# EAGLE design EEGbreakoutREVB (EAGLE 7.1.0)
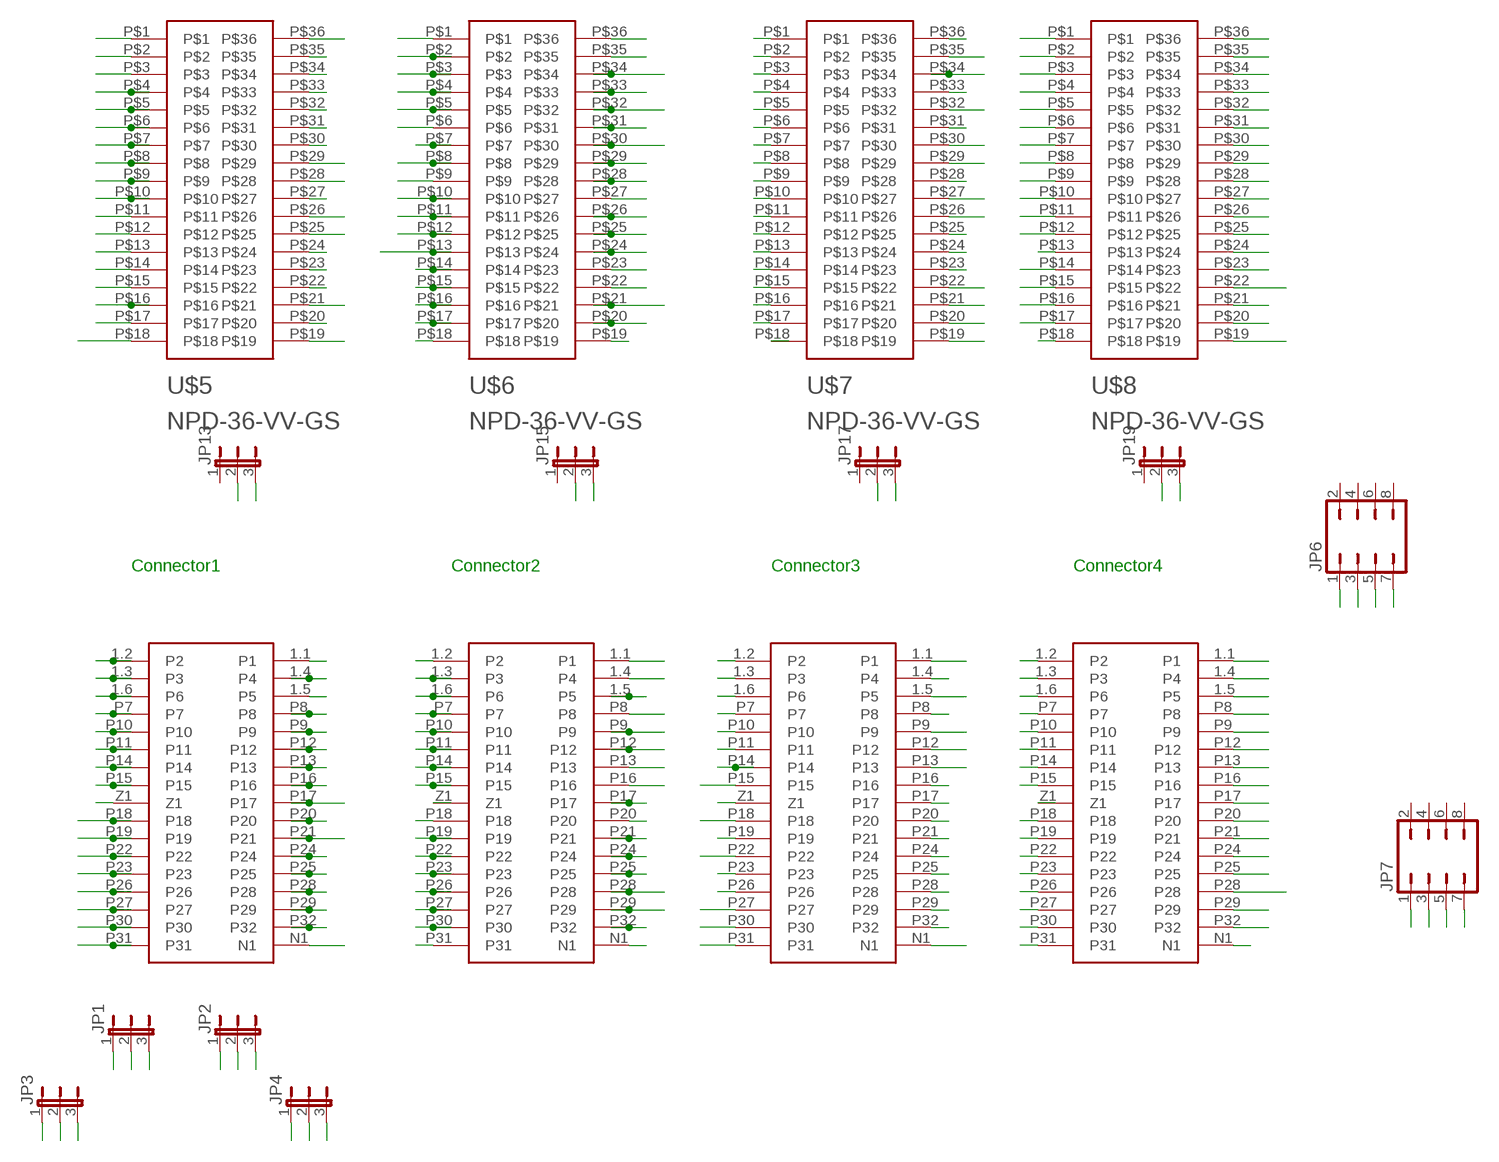
[diagram p0: schematic, sheet 1]

## Parts
JP1  JP2E  [JP2]
JP2  JP2E  [JP2]
JP3  JP2E  [JP2]
JP4  JP2E  [JP2]
JP6  JP4Q  [JP4Q]
JP7  JP4Q  [JP4Q]
JP13  JP2E  [JP2]
JP15  JP2E  [JP2]
JP17  JP2E  [JP2]
JP19  JP2E  [JP2]
U$1  P50  [CON-MOLEX_71061-0003SM]
U$2  P50  [CON-MOLEX_71061-0003SM]
U$3  P50  [CON-MOLEX_71061-0003SM]
U$4  P50  [CON-MOLEX_71061-0003SM]
U$5  NPD-36-VV-GS  [NPD-36-VV-GS]
U$6  NPD-36-VV-GS  [NPD-36-VV-GS]
U$7  NPD-36-VV-GS  [NPD-36-VV-GS]
U$8  NPD-36-VV-GS  [NPD-36-VV-GS]

## Nets
1.1: U$1.1.1(P1) U$5.P$2
1.2: U$1.1.4(P4) U$5.P$3
1.3: U$1.1.5(P5) U$5.P$4
1.4: U$1.P8 U$5.P$5
1.5: U$1.P9 U$5.P$6
1.6: U$1.P12 U$5.P$7
1.7: U$1.P13 U$5.P$8
1.8: U$1.P16 U$5.P$9
1.9: U$1.P17 U$5.P$10
1.10: U$1.P20 U$5.P$11
1.11: U$1.P21 U$5.P$12
1.12: U$1.P24 U$5.P$13
1.13: U$1.P25 U$5.P$14
1.14: U$1.P28 U$5.P$15
1.15: U$1.P29 U$5.P$16
1.16: U$1.P32 U$5.P$17
1.17: U$1.1.2(P2) U$5.P$20
1.18: U$1.1.3(P3) U$5.P$21
1.20: U$1.P7 U$5.P$23
1.21: U$1.P10 U$5.P$24
1.22: U$1.P11 U$5.P$25
1.23: U$1.P14 U$5.P$26
1.24: U$1.P15 U$5.P$27
1.25: U$1.P18 U$5.P$28
1.26: U$1.P19 U$5.P$29
1.27: U$1.P22 U$5.P$30
1.28: U$1.P23 U$5.P$31
1.29: JP4.2 U$5.P$32
1.30: JP2.2 U$5.P$33
1.31: JP1.2 U$5.P$34
1.32: JP3.2 U$5.P$35
2.1: U$2.1.1(P1) U$6.P$2
2.2: U$2.1.4(P4) U$6.P$3
2.3: U$2.1.5(P5) U$6.P$4
2.4: U$2.P8 U$6.P$5
2.5: U$2.P9 U$6.P$6
2.6: U$2.P12 U$6.P$7
2.7: U$2.P13 U$6.P$8
2.8: U$2.P16 U$6.P$9
2.9: U$2.P17 U$6.P$10
2.10: U$2.P20 U$6.P$11
2.11: U$2.P21 U$6.P$12
2.12: U$2.P24 U$6.P$13
2.13: U$2.P25 U$6.P$14
2.14: U$2.P28 U$6.P$15
2.15: U$2.P29 U$6.P$16
2.16: U$2.P32 U$6.P$17
2.17: U$2.1.2(P2) U$6.P$20
2.18: U$2.1.3(P3) U$6.P$21
2.19: U$2.1.6(P6) U$6.P$22
2.20: U$2.P7 U$6.P$23
2.21: U$2.P10 U$6.P$24
2.22: U$2.P11 U$6.P$25
2.23: U$2.P14 U$6.P$26
2.24: U$2.P15 U$6.P$27
2.25: U$2.P18 U$6.P$28
2.26: U$2.P19 U$6.P$29
2.27: U$2.P22 U$6.P$30
2.28: U$2.P23 U$6.P$31
2.29: U$2.P26 U$6.P$32
2.30: U$2.P27 U$6.P$33
2.31: U$2.P30 U$6.P$34
2.32: U$2.P31 U$6.P$35
3.1: U$3.1.1(P1) U$7.P$2
3.2: U$3.1.4(P4) U$7.P$3
3.3: U$3.1.5(P5) U$7.P$4
3.4: U$3.P8 U$7.P$5
3.5: U$3.P9 U$7.P$6
3.6: U$3.P12 U$7.P$7
3.7: U$3.P13 U$7.P$8
3.8: U$3.P16 U$7.P$9
3.9: U$3.P17 U$7.P$10
3.10: U$3.P20 U$7.P$11
3.11: U$3.P21 U$7.P$12
3.12: U$3.P24 U$7.P$13
3.13: U$3.P25 U$7.P$14
3.14: U$3.P28 U$7.P$15
3.15: U$3.P29 U$7.P$16
3.16: U$3.P32 U$7.P$17
3.17: U$3.1.2(P2) U$7.P$20
3.18: U$3.1.3(P3) U$7.P$21
3.19: U$3.1.6(P6) U$7.P$22
3.20: U$3.P7 U$7.P$23
3.21: U$3.P10 U$7.P$24
3.22: U$3.P11 U$7.P$25
3.23: U$3.P14 U$7.P$26
3.24: U$3.P15 U$7.P$27
3.25: U$3.P18 U$7.P$28
3.26: U$3.P19 U$7.P$29
3.27: U$3.P22 U$7.P$30
3.28: U$3.P23 U$7.P$31
3.29: U$3.P26 U$7.P$32
3.30: U$3.P27 U$7.P$33
3.31: U$3.P30 U$7.P$34
3.32: U$3.P31 U$7.P$35
4.1: U$4.1.1(P1) U$8.P$2
4.2: U$4.1.4(P4) U$8.P$3
4.3: U$4.1.5(P5) U$8.P$4
4.4: U$4.P8 U$8.P$5
4.5: U$4.P9 U$8.P$6
4.6: U$4.P12 U$8.P$7
4.7: U$4.P13 U$8.P$8
4.8: U$4.P16 U$8.P$9
4.9: U$4.P17 U$8.P$10
4.10: U$4.P20 U$8.P$11
4.11: U$4.P21 U$8.P$12
4.12: U$4.P24 U$8.P$13
4.13: U$4.P25 U$8.P$14
4.14: U$4.P28 U$8.P$15
4.15: U$4.P29 U$8.P$16
4.16: U$4.P32 U$8.P$17
4.17: U$4.1.2(P2) U$8.P$20
4.18: U$4.1.3(P3) U$8.P$21
4.19: U$4.1.6(P6) U$8.P$22
4.20: U$4.P7 U$8.P$23
4.21: U$4.P10 U$8.P$24
4.22: U$4.P11 U$8.P$25
4.23: U$4.P14 U$8.P$26
4.24: U$4.P15 U$8.P$27
4.25: U$4.P18 U$8.P$28
4.26: U$4.P19 U$8.P$29
4.27: U$4.P22 U$8.P$30
4.28: U$4.P23 U$8.P$31
4.29: U$4.P26 U$8.P$32
4.30: U$4.P27 U$8.P$33
4.31: U$4.P30 U$8.P$34
4.32: U$4.P31 U$8.P$35
C1.29: JP4.1 U$1.P26
C1.30: JP2.1 U$1.P27
C1.31: JP1.1 U$1.P30
C1.32: JP3.1 U$1.P31
GND: JP13.3 JP15.3 JP17.3 JP19.3 U$1.N1 U$2.N1 U$3.N1 U$4.N1 U$5.P$1 U$5.P$19 U$6.P$1 U$6.P$19 U$7.P$1 U$7.P$19 U$8.P$1 U$8.P$19
J29: JP4.3 JP6.1
J30: JP2.3 JP6.3
J31: JP1.3 JP6.5
J32: JP3.3 JP6.7
N$10: U$1.1.6(P6) U$5.P$22
REF: JP7.1 JP13.2 U$1.Z1 U$5.P$18 U$5.P$36
REF1: JP7.3 JP15.2 U$2.Z1 U$6.P$18 U$6.P$36
REF2: JP7.5 JP17.2 U$3.Z1 U$7.P$18 U$7.P$36
REF3: JP7.7 JP19.2 U$4.Z1 U$8.P$18 U$8.P$36
Unconnected: JP6.2 JP6.4 JP6.6 JP6.8 JP7.2 JP7.4 JP7.6 JP7.8 JP13.1 JP15.1 JP17.1 JP19.1

## Notes on the sheet
- Connector1 | Connector2 | Connector3 | Connector4

## Library data of the parts
JP1-JP4 JP13 JP15 JP17 JP19 = jumper:JP2E: JUMPER
JP6 JP7 = jumper:JP4Q: JUMPER
U$1-U$4 = MS001-1_4xNutzEURO:P50
U$5-U$8 = connectors:NPD-36-VV-GS: Omnetics 36-pin connector, vertical surface-mount

## Board
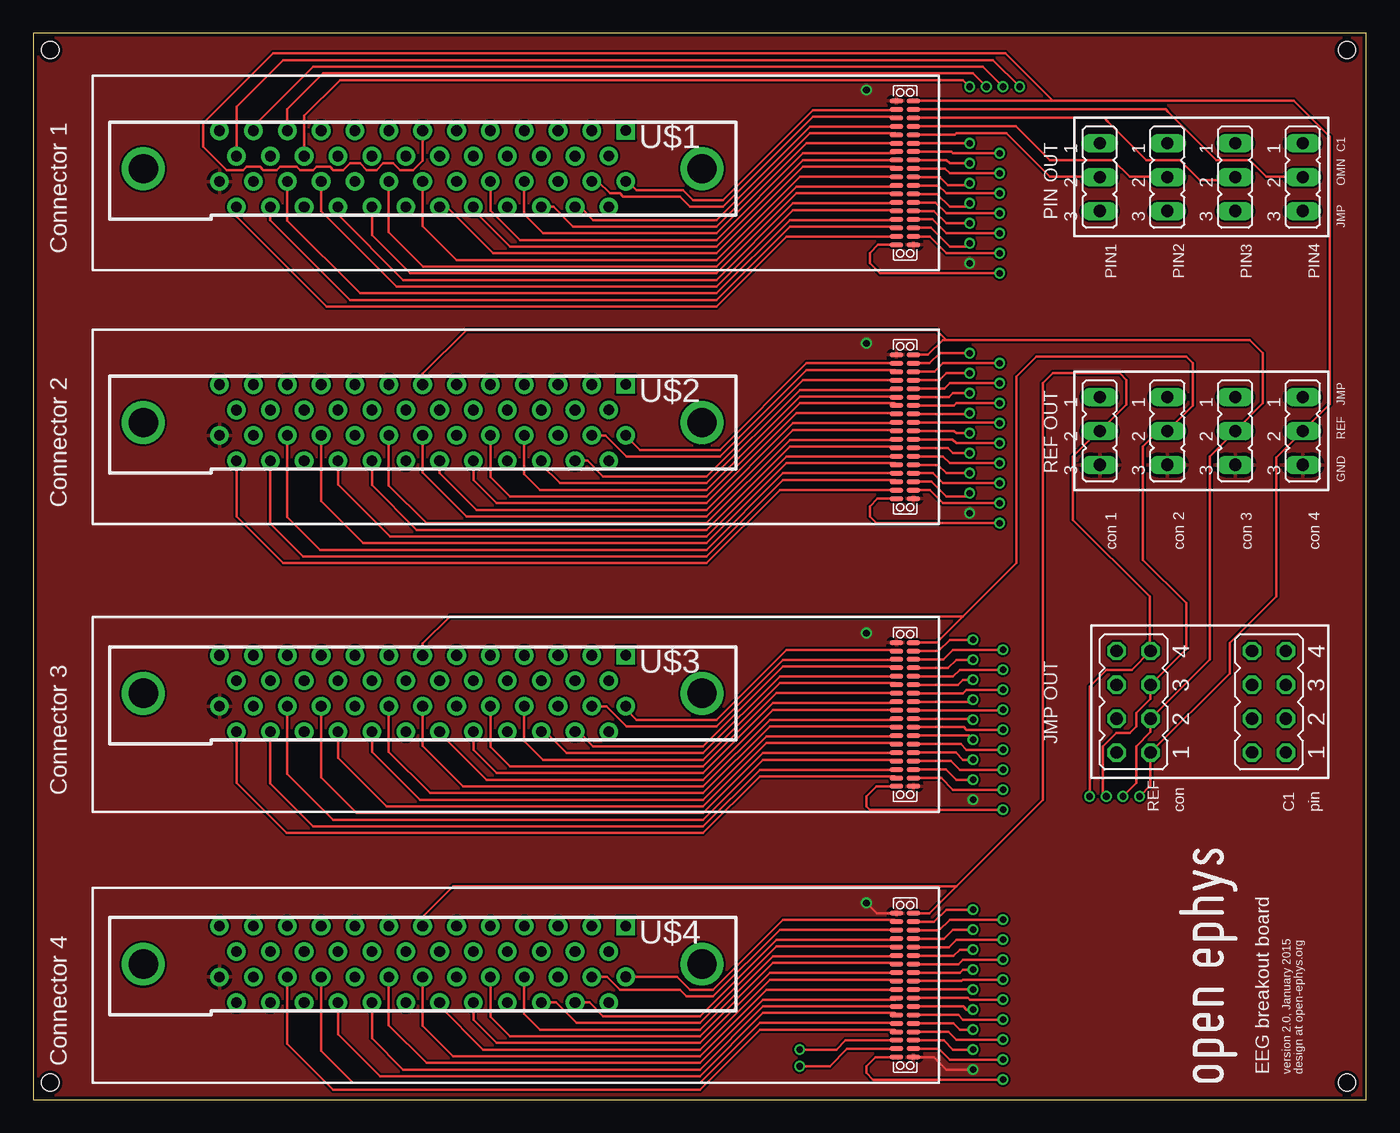
[diagram p1: board, top side]
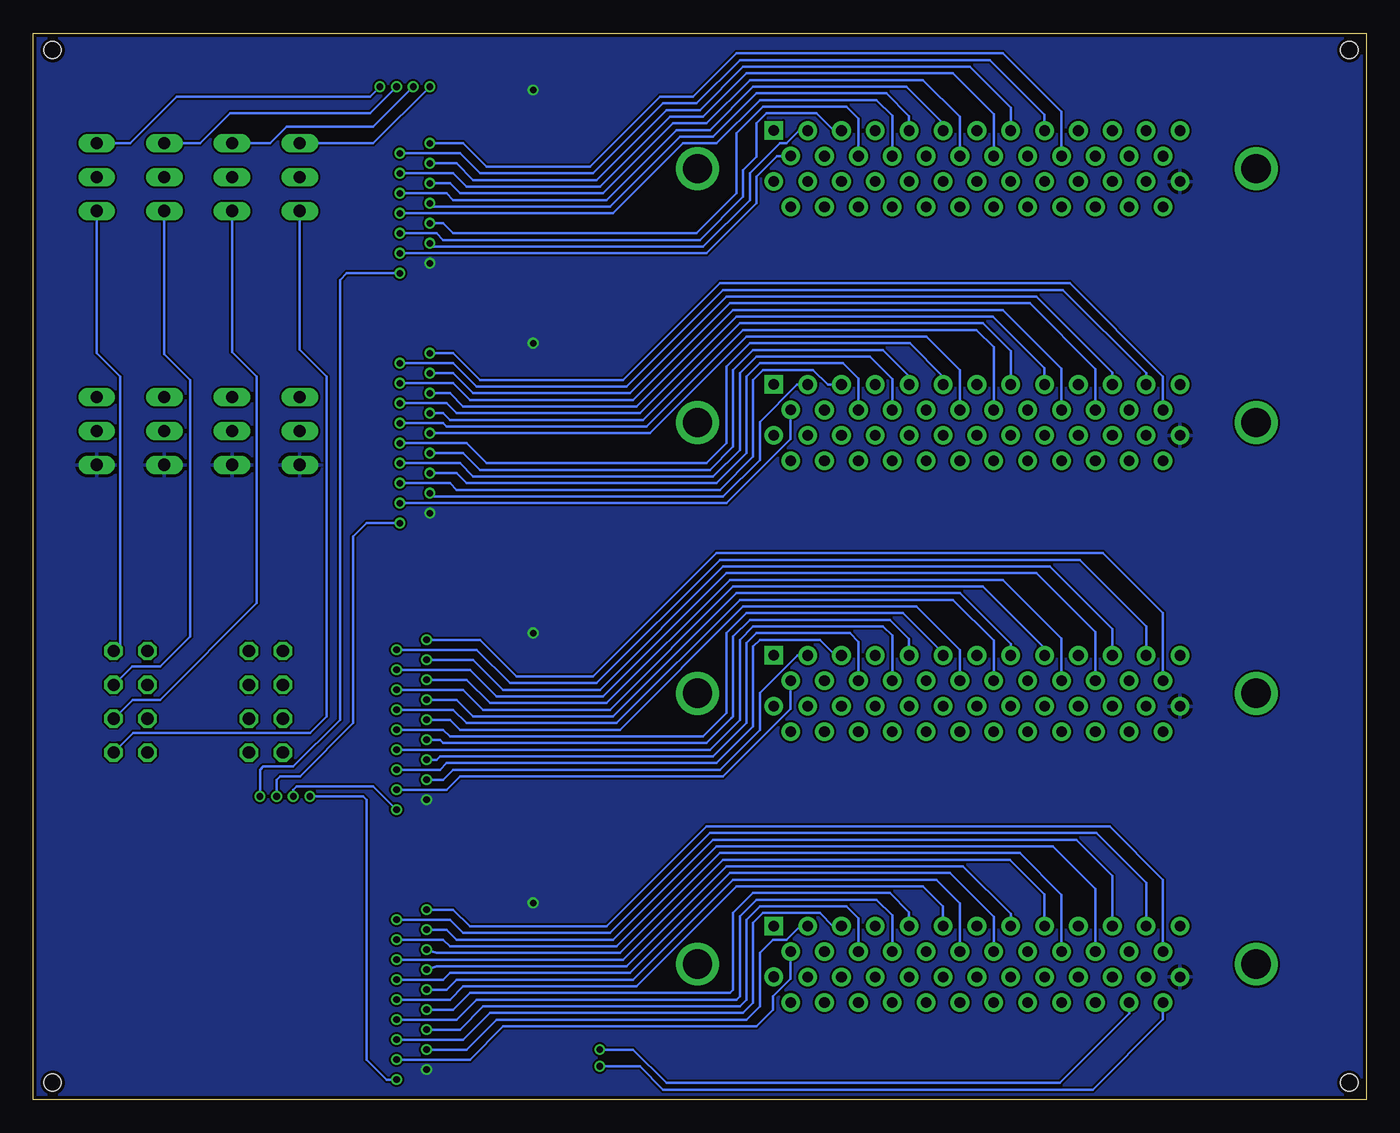
[diagram p2: board, bottom side, seen from below]

Size 100 x 80 mm. Coordinates in mm from the lower left corner, seen from the top.
Outline: 0,0 100,0 100,80 0,80 0,0
Copper layers (1*16): Top 0.035mm / dielectric 0.2mm / Bottom 0.035mm
Design rules "SeeedStudio_DRU_no_angle_20130527 *": minimum track width 6mil, minimum drill 12mil, track to track 6mil, track to pad 6mil, pad to pad 6mil, via to via 6mil, smd to smd 0mil, copper to edge 10mil, drill to drill 10mil, minimum pad ring 6mil, minimum via ring 6mil, stop-mask expansion 2mil, vias tented up to drill 25mil, thermal gap 10mil
Holes 1.3 mm at 98.55,78.74 98.55,1.27 1.27,78.74 1.27,1.27

### Footprints (pad centres in the part's own frame; a part is rotated, then mirrored left to right if it is on the bottom)
JP2 = drill 0.914 long: 1 -2.54,0; 2 0,0; 3 2.54,0
JP4Q = drill 0.914 octagon: 1 -3.81,-1.27; 2 -3.81,1.27; 3 -1.27,-1.27; 4 -1.27,1.27; 5 1.27,-1.27; 6 1.27,1.27; 7 3.81,-1.27; 8 3.81,1.27
CON-MOLEX_71061-0003SM = drill 0.8 pad 1.4 square: 0 15.24,2.857 | drill 0.8 pad 1.4: 1.1 15.24,-0.958; 1.2 13.97,0.943; 1.3 12.7,2.842; 1.4 12.7,-0.968; 1.5 11.43,-2.873; 1.6 10.16,2.842; 4 13.97,-2.873; 7 11.43,0.938; 10 10.16,-0.968; 13 7.62,2.842; 16 6.35,-2.873; 19 3.81,0.938; 22 2.54,-0.968; 28 -1.27,-2.873; 31 -3.81,0.938; 34 -5.08,-0.968; 37 -7.62,2.842; 40 -8.89,-2.873; 43 -11.43,0.938; 46 -12.7,-0.968; 49 -15.24,2.842; N1 -15.24,-0.968; P7 8.89,0.938; P8 8.89,-2.873; P9 7.62,-0.968; P10 6.35,0.938; P11 5.08,2.842; P12 5.08,-0.968; P13 3.81,-2.873; P14 2.54,2.842; P15 1.27,0.938; P16 1.27,-2.873; P17 0,-0.968; P18 -1.27,0.938; P19 -2.54,2.842; P20 -2.54,-0.968; P21 -3.81,-2.873; P22 -5.08,2.842; P23 -6.35,0.938; P24 -6.35,-2.873; P25 -7.62,-0.968; P26 -8.89,0.938; P27 -10.16,2.842; P28 -10.16,-0.968; P29 -11.43,-2.873; P30 -12.7,2.842; P31 -13.97,0.938; P32 -13.97,-2.873; Z1 0,2.842 | drill 2.2 pad 2.6: Y1 20.955,0; Y2 -20.955,0
NPD-36-VV-GS = smd 0.381 x 1.016: P$1 0,0; P$2 0.635,0; P$3 1.27,0; P$4 1.905,0; P$5 2.54,0; P$6 3.175,0; P$7 3.81,0; P$8 4.445,0; P$9 5.08,0; P$10 5.715,0; P$11 6.35,0; P$12 6.985,0; P$13 7.62,0; P$14 8.255,0; P$15 8.89,0; P$16 9.525,0; P$17 10.16,0; P$18 10.795,0; P$19 10.795,1.27; P$20 10.16,1.27; P$21 9.525,1.27; P$22 8.89,1.27; P$23 8.255,1.27; P$24 7.62,1.27; P$25 6.985,1.27; P$26 6.35,1.27; P$27 5.715,1.27; P$28 5.08,1.27; P$29 4.445,1.27; P$30 3.81,1.27; P$31 3.175,1.27; P$32 2.54,1.27; P$33 1.905,1.27; P$34 1.27,1.27; P$35 0.635,1.27; P$36 0,1.27

### Placement (x,y rotation side)
JP1  90.17,69.22 270 top
JP2  85.09,69.22 270 top
JP3  95.25,69.22 270 top
JP4  80.01,69.22 270 top
JP6  92.71,29.84 90 top
JP7  82.55,29.84 90 top
JP13  95.25,50.16 270 top
JP15  90.17,50.16 270 top
JP17  85.09,50.16 270 top
JP19  80.01,50.16 270 top
U$1  29.21,69.85 0 top
U$2  29.21,50.8 0 top
U$3  29.21,30.48 0 top
U$4  29.21,10.16 0 top
U$5  64.77,74.93 270 top
U$6  64.77,55.88 270 top
U$7  64.77,34.29 270 top
U$8  64.77,13.97 270 top
U$9  [OPEN_EPHYS_LOGO]  90.81,0.64 90 top

### Tracks (layer width: path | path; a pad name or v marks a point on that pad's centre or on a via)
1.1
  Top 0.2: U$1.1.1 44.61,68.89 45.25,68.25 48.75,68.25 49.5,67.5 51.75,67.5 58.5,74.25 64.72,74.25 U$5.P$2
1.2
  Top 0.2: U$5.P$3 64.68,73.75 58.5,73.75 51.75,67 49.25,67 48.5,67.75 44.25,67.75 44,68 43.25,68 42.37,68.88 U$1.1.4
1.3
  Top 0.2: U$1.1.5 41.02,66.98 42,66 51.25,66 58.25,73 64.75,73 U$5.P$4
1.4
  Top 0.2: U$1.P8 39.02,66.98 40.5,65.5 51.25,65.5 58.25,72.5 64.66,72.5 U$5.P$5
1.5
  Top 0.2: U$1.P9 36.83,66.42 38.25,65 51.25,65 58,71.75 U$5.P$6
1.6
  Top 0.2: U$1.P12 34.29,66.71 36.5,64.5 51.25,64.5 57.75,71 64.65,71 U$5.P$7
1.7
  Top 0.2: U$1.P13 33.02,66.73 35.75,64 51.25,64 57.75,70.5 64.75,70.5 U$5.P$8
1.8
  Top 0.2: U$1.P16 31.02,66.98 34.5,63.5 51.25,63.5 57.75,70 64.62,70 U$5.P$9
1.9
  Top 0.2: U$1.P17 29.21,65.54 31.75,63 51.25,63 57.5,69.25 64.73,69.25 U$5.P$10
1.10
  Top 0.2: U$1.P20 26.67,65.08 29.25,62.5 51.25,62.5 57.25,68.5 64.69,68.5 U$5.P$11
1.11
  Top 0.2: U$1.P21 25.4,64.85 28.25,62 51.25,62 57.25,68 64.72,68 U$5.P$12
1.12
  Top 0.2: U$1.P24 22.86,66.39 27.75,61.5 51.25,61.5 57,67.25 64.71,67.25 U$5.P$13
1.13
  Top 0.2: U$1.P25 21.59,66.66 27.25,61 51.25,61 57,66.75 64.69,66.75 U$5.P$14
1.14
  Top 0.2: U$1.P28 19.05,65.95 24.5,60.5 51.25,60.5 56.75,66 64.73,66 U$5.P$15
1.15
  Top 0.2: U$1.P29 17.78,65.97 23.75,60 51.25,60 56.75,65.5 64.67,65.5 U$5.P$16
1.16
  Top 0.2: U$1.P32 15.24,66.26 22,59.5 51.25,59.5 56.5,64.75 64.75,64.75 U$5.P$17
1.17  (via drill 0.5 pad 0.25)
  Top 0.2: v72.5,63.5 68.5,63.5 67.25,64.75 66.06,64.75 U$5.P$20
  Bottom 0.2: U$1.1.2 44.21,70.79 45.75,69.25 45.75,67.25 49.5,63.5 v72.5,63.5
1.18  (via drill 0.5 pad 0.25)
  Top 0.2: U$5.P$21 67.34,65.41 68.75,64 70,64 v70.25,64.25
  Bottom 0.2: U$1.1.3 42.56,72.69 43.5,71.75 44,71.75 46.25,69.5 46.25,67.5 49.75,64 70,64 v70.25,64.25
1.20  (via drill 0.5 pad 0.25)
  Top 0.2: U$5.P$23 67.58,66.67 68.5,65.75 v70.25,65.75
  Bottom 0.2: U$1.P7 38.1,73.6 39,74.5 45.25,74.5 47.25,72.5 47.25,68 50.25,65 68.5,65 69.25,65.75 v70.25,65.75
1.21  (via drill 0.5 pad 0.25)
  Top 0.2: U$5.P$24 67.69,67.31 68.5,66.5 v72.5,66.5
  Bottom 0.2: U$1.P10 35.56,73.81 36.75,75 45.5,75 48.75,71.75 51.25,71.75 56.5,66.5 v72.5,66.5
1.22  (via drill 0.5 pad 0.25)
  Top 0.2: U$5.P$25 67.81,67.94 68.75,67 70,67 v70.25,67.25
  Bottom 0.2: U$1.P11 34.29,73.79 36,75.5 45.75,75.5 49,72.25 51.5,72.25 56.75,67 70,67 v70.25,67.25
1.23  (via drill 0.5 pad 0.25)
  Top 0.2: U$5.P$26 67.92,68.58 68.5,68 v72.5,68
  Bottom 0.2: U$1.P14 31.75,73.25 34.5,76 46,76 49.25,72.75 51.75,72.75 57,67.5 68.5,67.5 69,68 v72.5,68
1.24  (via drill 0.5 pad 0.25)
  Top 0.2: U$5.P$27 68.03,69.22 68.62,68.62 70.12,68.62 v70.25,68.75
  Bottom 0.2: U$1.P15 30.48,73.73 33.25,76.5 46.25,76.5 49.5,73.25 52,73.25 57.25,68 68,68 68.75,68.75 v70.25,68.75
1.25  (via drill 0.5 pad 0.25)
  Top 0.2: U$5.P$28 68.4,69.85 68.75,69.5 v72.5,69.5
  Bottom 0.2: U$1.P18 27.94,73.94 31,77 46.5,77 49.75,73.75 52.25,73.75 57.5,68.5 67.5,68.5 68.5,69.5 v72.5,69.5
1.26  (via drill 0.5 pad 0.25)
  Top 0.2: U$5.P$29 68.52,70.48 68.75,70.25 v70.25,70.25
  Bottom 0.2: U$1.P19 26.67,74.42 29.75,77.5 46.75,77.5 50,74.25 52.5,74.25 57.75,69 67,69 68.25,70.25 v70.25,70.25
1.27  (via drill 0.5 pad 0.25)
  Top 0.2: U$5.P$30 68.88,71.12 69,71 v72.5,71
  Bottom 0.2: U$1.P22 24.13,73.88 28.25,78 47,78 50.25,74.75 52.75,74.75 58,69.5 66.5,69.5 68,71 v72.5,71
1.28  (via drill 0.5 pad 0.25)
  Top 0.2: U$5.P$31 v70.25,71.75
  Bottom 0.2: U$1.P23 22.86,74.11 27.25,78.5 47.25,78.5 50.5,75.25 53,75.25 58.25,70 66,70 67.75,71.75 v70.25,71.75
1.29
  Top 0.2: JP4.2 79.97,69.25 76.25,69.25 73,72.5 69.25,72.5 69.14,72.39 U$5.P$32
1.30
  Top 0.2: JP2.2 85.06,69.25 82.25,69.25 81,70.5 76.25,70.5 73.72,73.03 U$5.P$33
1.31
  Top 0.2: JP1.2 89.95,69 87.5,69 86,70.5 83.5,70.5 80.62,73.38 80.34,73.66 U$5.P$34
1.32
  Top 0.2: JP3.2 95.22,69.25 92.5,69.25 91.25,70.5 88.75,70.5 85.12,74.12 84.95,74.3 U$5.P$35
2.1
  Top 0.2: U$2.1.1 44.45,49.8 45.5,48.75 51.5,48.75 58,55.25 U$6.P$2
2.2
  Top 0.2: U$2.1.4 42.92,49.83 44.5,48.25 51.5,48.25 58,54.75 64.63,54.75 U$6.P$3
2.3
  Top 0.2: U$2.1.5 41.57,47.93 42.75,46.75 50.5,46.75 57.75,54 64.75,54 U$6.P$4
2.4
  Top 0.2: U$2.P8 38.1,47.65 39.5,46.25 50.5,46.25 57.5,53.25 64.68,53.25 U$6.P$5
2.5
  Top 0.2: U$2.P9 36.83,46.92 38,45.75 50.5,45.75 57.5,52.75 64.72,52.75 U$6.P$6
2.6
  Top 0.2: U$2.P12 34.29,46.71 35.75,45.25 50.5,45.25 57.5,52.25 64.59,52.25 U$6.P$7
2.7
  Top 0.2: U$2.P13 33.02,46.48 34.75,44.75 50.5,44.75 57.25,51.5 64.7,51.5 U$6.P$8
2.8
  Top 0.2: U$2.P16 30.48,47.02 33.25,44.25 50.5,44.25 57,50.75 64.72,50.75 U$6.P$9
2.9
  Top 0.2: U$2.P17 29.21,47.04 32.5,43.75 50.5,43.75 57,50.25 64.69,50.25 U$6.P$10
2.10
  Top 0.2: U$2.P20 26.67,46.08 29.5,43.25 50.5,43.25 56.75,49.5 64.74,49.5 U$6.P$11
2.11
  Top 0.2: U$2.P21 25.4,46.1 28.75,42.75 50.5,42.75 56.75,49 64.67,49 U$6.P$12
2.12
  Top 0.2: U$2.P24 22.86,46.14 26.75,42.25 50.5,42.25 56.5,48.25 U$6.P$13
2.13
  Top 0.2: U$2.P25 21.59,44.91 24.75,41.75 50.5,41.75 56.5,47.75 64.64,47.75 U$6.P$14
2.14
  Top 0.2: U$2.P28 19.05,43.7 21.5,41.25 50.5,41.25 56.25,47 U$6.P$15
2.15
  Top 0.2: U$2.P29 17.78,43.22 20.25,40.75 50.5,40.75 56.25,46.5 64.62,46.5 U$6.P$16
2.16
  Top 0.2: U$2.P32 15.24,43.76 18.75,40.25 50.5,40.25 56,45.75 56.03,45.72 U$6.P$17
2.17  (via drill 0.5 pad 0.25)
  Top 0.2: U$6.P$20 67.28,45.72 68.25,44.75 v72.5,44.75
  Bottom 0.2: U$2.1.2 43.18,49.57 48,44.75 v72.5,44.75
2.18  (via drill 0.5 pad 0.25)
  Top 0.2: U$6.P$21 67.39,46.35 68.5,45.25 70,45.25 v70.25,45.5
  Bottom 0.2: v70.25,45.5 70,45.25 48.25,45.25 45.5,48 45.5,50.84 42.7,53.64 U$2.1.3
2.19  (via drill 0.5 pad 0.25)
  Top 0.2: U$6.P$22 67.51,46.99 68.25,46.25 v72.5,46.25
  Bottom 0.2: U$2.1.6 40.39,53.64 41.5,54.75 45.25,54.75 46,54 46,48.25 48.5,45.75 68.25,45.75 68.75,46.25 v72.5,46.25
2.20  (via drill 0.5 pad 0.25)
  Top 0.2: U$6.P$23 67.88,47.62 68.5,47 v70.25,47
  Bottom 0.2: U$2.P7 38.1,54.1 39.25,55.25 45.5,55.25 46.5,54.25 46.5,48.5 48.75,46.25 67.5,46.25 68.25,47 v70.25,47
2.21  (via drill 0.5 pad 0.25)
  Top 0.2: U$6.P$24 68.24,48.26 68.75,47.75 v72.5,47.75
  Bottom 0.2: U$2.P10 35.56,54.06 37.25,55.75 45.75,55.75 47,54.5 47,48.75 49,46.75 67,46.75 68,47.75 v72.5,47.75
2.22  (via drill 0.5 pad 0.25)
  Top 0.2: U$6.P$25 68.61,48.9 69,48.5 v70.25,48.5
  Bottom 0.2: U$2.P11 34.29,54.29 36.25,56.25 46,56.25 47.5,54.75 47.5,49 49.25,47.25 66.5,47.25 67.75,48.5 v70.25,48.5
2.23  (via drill 0.5 pad 0.25)
  Top 0.2: U$6.P$26 68.97,49.53 69.25,49.25 v72.5,49.25
  Bottom 0.2: U$2.P14 31.75,54.25 34.25,56.75 46.25,56.75 48,55 48,49.25 49.5,47.75 66,47.75 67.5,49.25 v72.5,49.25
2.24  (via drill 0.5 pad 0.25)
  Top 0.2: U$6.P$27 69.08,50.16 69.25,50 v70.25,50
  Bottom 0.2: U$2.P15 30.48,54.73 33,57.25 46.5,57.25 53.75,50 v70.25,50
2.25  (via drill 0.5 pad 0.25)
  Top 0.2: U$6.P$28 72.45,50.8 v72.5,50.75
  Bottom 0.2: U$2.P18 27.94,56.44 29.25,57.75 46.75,57.75 54,50.5 69,50.5 69.25,50.75 v72.5,50.75
2.26  (via drill 0.5 pad 0.25)
  Top 0.2: U$6.P$29 70.19,51.44 v70.25,51.5
  Bottom 0.2: U$2.P19 26.67,56.17 28.75,58.25 47,58.25 54.25,51 68.75,51 69.25,51.5 v70.25,51.5
2.27  (via drill 0.5 pad 0.25)
  Top 0.2: U$6.P$30 69.07,52.07 69.25,52.25 v72.5,52.25
  Bottom 0.2: U$2.P22 24.13,54.88 28,58.75 47.25,58.75 54.5,51.5 68.25,51.5 69,52.25 v72.5,52.25
2.28  (via drill 0.5 pad 0.25)
  Top 0.2: U$6.P$31 68.7,52.7 69,53 v70.25,53
  Bottom 0.2: U$2.P23 22.86,54.86 27.25,59.25 47.5,59.25 54.75,52 67.75,52 68.75,53 v70.25,53
2.29  (via drill 0.5 pad 0.25)
  Top 0.2: U$6.P$32 68.34,53.34 68.75,53.75 v72.5,53.75
  Bottom 0.2: U$2.P26 20.32,54.82 25.25,59.75 47.75,59.75 55,52.5 67.25,52.5 68.5,53.75 v72.5,53.75
2.30  (via drill 0.5 pad 0.25)
  Top 0.2: U$6.P$33 67.97,53.98 68.5,54.5 v70.25,54.5
  Bottom 0.2: U$2.P27 19.05,54.55 24.75,60.25 48,60.25 55.25,53 67,53 68.5,54.5 v70.25,54.5
2.31  (via drill 0.5 pad 0.25)
  Top 0.2: U$6.P$34 67.61,54.61 68.25,55.25 v72.5,55.25
  Bottom 0.2: U$2.P30 16.51,54.51 22.75,60.75 48.25,60.75 55.5,53.5 66.75,53.5 68.5,55.25 v72.5,55.25
2.32  (via drill 0.5 pad 0.25)
  Top 0.2: U$6.P$35 67.25,55.24 68,56 v70.25,56
  Bottom 0.2: U$2.P31 15.24,54.24 22.25,61.25 48.5,61.25 55.75,54 66.5,54 68.5,56 v70.25,56
3.1
  Top 0.2: U$3.1.1 44.45,29.3 45.25,28.5 51.25,28.5 56.5,33.75 64.67,33.75 U$7.P$2
3.2
  Top 0.2: U$3.1.4 42.99,29.51 44.5,28 51.25,28 56.25,33 64.75,33 U$7.P$3
3.3
  Top 0.2: U$3.1.5 40.89,27.61 42,26.5 50.25,26.5 56.25,32.5 64.66,32.5 U$7.P$4
3.4
  Top 0.2: U$3.P8 38.39,27.61 40,26 50.25,26 56,31.75 U$7.P$5
3.5
  Top 0.2: U$3.P9 36.83,26.92 38.25,25.5 50.25,25.5 56,31.25 64.64,31.25 U$7.P$6
3.6
  Top 0.2: U$3.P12 34.29,26.46 35.75,25 50.25,25 55.75,30.5 64.75,30.5 U$7.P$7
3.7
  Top 0.2: U$3.P13 33.02,26.23 34.75,24.5 50.25,24.5 55.5,29.75 64.67,29.75 U$7.P$8
3.8
  Top 0.2: U$3.P16 30.48,27.52 34,24 50.25,24 55.5,29.25 64.73,29.25 U$7.P$9
3.9
  Top 0.2: U$3.P17 29.21,26.54 32.25,23.5 50.25,23.5 55.25,28.5 64.69,28.5 U$7.P$10
3.10
  Top 0.2: U$3.P20 26.67,26.08 29.75,23 50.25,23 55.25,28 64.71,28 U$7.P$11
3.11
  Top 0.2: U$3.P21 25.4,26.1 29,22.5 50.25,22.5 55,27.25 64.72,27.25 U$7.P$12
3.12
  Top 0.2: U$3.P24 22.86,25.64 26.5,22 50.25,22 55,26.75 64.69,26.75 U$7.P$13
3.13
  Top 0.2: U$3.P25 21.59,24.16 24.25,21.5 50.25,21.5 54.75,26 64.73,26 U$7.P$14
3.14
  Top 0.2: U$3.P28 19.05,24.45 22.5,21 50.25,21 54.75,25.5 64.67,25.5 U$7.P$15
3.15
  Top 0.2: U$3.P29 17.78,23.72 21,20.5 50.25,20.5 54.5,24.75 64.75,24.75 U$7.P$16
3.16
  Top 0.2: U$3.P32 15.24,23.76 19,20 50.25,20 54.5,24.25 64.65,24.25 U$7.P$17
3.17  (via drill 0.5)
  Top 0.2: U$7.P$20 68.12,24.13 69,23.25 v72.75,23.25
  Bottom 0.2: U$3.1.2 43.18,29.32 48.25,24.25 68,24.25 69,23.25 v72.75,23.25
3.18  (via drill 0.5)
  Top 0.2: U$7.P$21 68.48,24.77 69.25,24 v70.5,24
  Bottom 0.2: U$3.1.3 42.68,33.32 45.5,30.5 45.5,27.75 48.5,24.75 68.5,24.75 69.25,24 v70.5,24
3.19  (via drill 0.5)
  Top 0.2: U$7.P$22 68.85,25.4 69.5,24.75 v72.75,24.75
  Bottom 0.2: U$3.1.6 39.82,33.32 41,34.5 45.5,34.5 46,34 46,28 48.75,25.25 69,25.25 69.5,24.75 v72.75,24.75
3.20  (via drill 0.5)
  Top 0.2: U$7.P$23 69.22,26.04 69.75,25.5 v70.5,25.5
  Bottom 0.2: U$3.P7 38.1,34.35 38.75,35 45.75,35 46.5,34.25 46.5,28.25 49,25.75 69.5,25.75 69.75,25.5 v70.5,25.5
3.21  (via drill 0.5)
  Top 0.2: U$7.P$24 69.58,26.67 70,26.25 v72.75,26.25
  Bottom 0.2: U$3.P10 35.56,34.81 36.25,35.5 46,35.5 47,34.5 47,28.5 49.25,26.25 v72.75,26.25
3.22  (via drill 0.5)
  Top 0.2: U$7.P$25 70.19,27.3 v70.5,27
  Bottom 0.2: U$3.P11 34.29,34.54 35.75,36 46.25,36 47.5,34.75 47.5,28.75 47.62,28.62 49.5,26.75 69.25,26.75 69.5,27 v70.5,27
3.23  (via drill 0.5)
  Top 0.2: U$7.P$26 69.81,27.94 70,27.75 v72.75,27.75
  Bottom 0.2: U$3.P14 31.75,33.5 34.75,36.5 46.5,36.5 48,35 48,29 49.75,27.25 68.75,27.25 69.25,27.75 v72.75,27.75
3.24  (via drill 0.5)
  Top 0.2: U$7.P$27 70.42,28.57 v70.5,28.5
  Bottom 0.2: U$3.P15 30.48,33.73 33.75,37 46.75,37 56,27.75 68,27.75 68.75,28.5 v70.5,28.5
3.25  (via drill 0.5)
  Top 0.2: U$7.P$28 72.71,29.21 v72.75,29.25
  Bottom 0.2: U$3.P18 27.94,34.44 31,37.5 47,37.5 56.25,28.25 67.5,28.25 68.5,29.25 v72.75,29.25
3.26  (via drill 0.5)
  Top 0.2: U$7.P$29 70.34,29.84 v70.5,30
  Bottom 0.2: U$3.P19 26.67,34.17 30.5,38 47.25,38 56.5,28.75 67,28.75 68.25,30 v70.5,30
3.27  (via drill 0.5)
  Top 0.2: U$7.P$30 69.73,30.48 70,30.75 v72.75,30.75
  Bottom 0.2: U$3.P22 24.13,33.88 28.75,38.5 47.5,38.5 56.75,29.25 66.25,29.25 67.75,30.75 v72.75,30.75
3.28  (via drill 0.5)
  Top 0.2: U$7.P$31 69.36,31.11 69.75,31.5 v70.5,31.5
  Bottom 0.2: U$3.P23 22.86,34.61 27.25,39 47.75,39 57,29.75 65.75,29.75 67.5,31.5 v70.5,31.5
3.29  (via drill 0.5)
  Top 0.2: U$7.P$32 69,31.75 69.5,32.25 v72.75,32.25
  Bottom 0.2: U$3.P26 20.32,35.07 24.75,39.5 48,39.5 57.25,30.25 65.25,30.25 67.25,32.25 v72.75,32.25
3.30  (via drill 0.5)
  Top 0.2: U$7.P$33 68.64,32.38 69.25,33 v70.5,33
  Bottom 0.2: U$3.P27 19.05,35.3 23.75,40 48.25,40 57.5,30.75 64.75,30.75 67,33 v70.5,33
3.31  (via drill 0.5)
  Top 0.2: U$7.P$34 68.27,33.02 69,33.75 v72.75,33.75
  Bottom 0.2: U$3.P30 16.51,35.51 21.5,40.5 48.5,40.5 57.75,31.25 64.25,31.25 66.75,33.75 v72.75,33.75
3.32  (via drill 0.5)
  Top 0.2: U$7.P$35 67.91,33.66 68.75,34.5 v70.5,34.5
  Bottom 0.2: U$3.P31 15.24,36.49 19.75,41 48.75,41 58,31.75 63.75,31.75 66.5,34.5 v70.5,34.5
4.1
  Top 0.2: U$4.1.1 48.3,9.2 49.25,8.25 51,8.25 56.25,13.5 64.61,13.5 U$8.P$2
4.2
  Top 0.2: U$4.1.4 43.06,9.19 44,8.25 48.5,8.25 49,7.75 51,7.75 56,12.75 64.72,12.75 U$8.P$3
4.3
  Top 0.2: U$4.1.5 41.71,7.29 42.75,6.25 50,6.25 55.75,12 64.7,12 U$8.P$4
4.4
  Top 0.2: U$4.P8 39.21,7.29 40.75,5.75 50,5.75 55.75,11.5 64.7,11.5 U$8.P$5
4.5
  Top 0.2: U$4.P9 36.83,6.42 38,5.25 50,5.25 55.5,10.75 64.72,10.75 U$8.P$6
4.6
  Top 0.2: U$4.P12 34.29,6.21 35.75,4.75 50,4.75 55.5,10.25 64.68,10.25 U$8.P$7
4.7
  Top 0.2: U$4.P13 33.02,5.98 34.75,4.25 50,4.25 55.25,9.5 64.75,9.5 U$8.P$8
4.8
  Top 0.2: U$4.P16 30.48,7.02 33.75,3.75 50,3.75 55.25,9 64.66,9 U$8.P$9
4.9
  Top 0.2: U$4.P17 29.21,5.54 31.5,3.25 50,3.25 55,8.25 U$8.P$10
4.10
  Top 0.2: U$4.P20 26.67,5.58 29.5,2.75 50,2.75 54.75,7.5 64.65,7.5 U$8.P$11
4.11
  Top 0.2: U$4.P21 25.4,4.6 27.75,2.25 50,2.25 54.75,7 64.75,7 U$8.P$12
4.12
  Top 0.2: U$4.P24 22.86,4.89 26,1.75 50,1.75 54.75,6.5 64.62,6.5 U$8.P$13
4.13
  Top 0.2: U$4.P25 21.59,3.66 24,1.25 50,1.25 54.5,5.75 64.73,5.75 U$8.P$14
4.14
  Top 0.2: U$4.P28 19.05,4.2 22.5,0.75 50,0.75 54.5,5.25 64.6,5.25 U$8.P$15
4.15  (via drill 0.5)
  Top 0.2: U$8.P$16 60.95,4.45 60.25,3.75 v57.5,3.75
  Bottom 0.2: U$4.P29 17.78,6.47 23,1.25 52.5,1.25 55,3.75 v57.5,3.75
4.16  (via drill 0.5)
  Top 0.2: U$8.P$17 61.06,3.81 59.75,2.5 v57.5,2.5
  Bottom 0.2: U$4.P32 15.24,6.01 20.5,0.75 52.75,0.75 54.5,2.5 v57.5,2.5
4.17  (via drill 0.5)
  Top 0.2: U$8.P$20 67.94,3.81 68.75,3 v72.75,3
  Bottom 0.2: v72.75,3 67.25,3 64.75,5.5 45.75,5.5 44.5,6.75 44.5,7.75 43.18,9.07 U$4.1.2
4.18  (via drill 0.5)
  Top 0.2: U$8.P$21 68.31,4.45 69,3.75 v70.5,3.75
  Bottom 0.2: v70.5,3.75 67.5,3.75 65.25,6 46.5,6 45.5,7 45.5,11 44.5,12 43.5,12 42.5,13 U$4.1.3
4.19  (via drill 0.5)
  Top 0.2: U$8.P$22 68.67,5.08 69.25,4.5 v72.75,4.5
  Bottom 0.2: U$4.1.6 40,13 41,14 45.25,14 46,13.25 46,7.25 46.75,6.5 65.75,6.5 67.75,4.5 v72.75,4.5
4.20  (via drill 0.5)
  Top 0.2: U$8.P$23 69.03,5.71 69.5,5.25 v70.5,5.25
  Bottom 0.2: U$4.P7 38.1,13.6 39,14.5 45.5,14.5 46.5,13.5 46.5,7.5 47,7 66.25,7 68,5.25 v70.5,5.25
4.21  (via drill 0.5)
  Top 0.2: U$8.P$24 69.4,6.35 69.75,6 v72.75,6
  Bottom 0.2: U$4.P10 35.56,13.81 36.75,15 45.75,15 47,13.75 47,7.75 47.25,7.5 66.75,7.5 68.25,6 v72.75,6
4.22  (via drill 0.5)
  Top 0.2: U$8.P$25 69.77,6.99 70,6.75 v70.5,6.75
  Bottom 0.2: U$4.P11 34.29,14.04 35.75,15.5 46,15.5 47.5,14 47.5,8.25 47.75,8 67.25,8 68.5,6.75 v70.5,6.75
4.23  (via drill 0.5)
  Top 0.2: U$8.P$26 70.13,7.62 70.25,7.5 v72.75,7.5
  Bottom 0.2: U$4.P14 31.75,14.5 33.25,16 47.25,16 54.75,8.5 67.75,8.5 68.75,7.5 v72.75,7.5
4.24  (via drill 0.5)
  Top 0.2: U$8.P$27 v70.5,8.26 v70.5,8.25
  Bottom 0.2: U$4.P15 30.48,14.73 32.25,16.5 47.5,16.5 55,9 68.25,9 69,8.25 v70.5,8.25
4.25  (via drill 0.5)
  Top 0.2: U$8.P$28 69.64,8.89 69.75,9 v72.75,9
  Bottom 0.2: U$4.P18 27.94,13.69 31.25,17 47.75,17 55.25,9.5 68.75,9.5 69.25,9 v72.75,9
4.26  (via drill 0.5)
  Top 0.2: U$8.P$29 69.53,9.53 69.75,9.75 v70.5,9.75
  Bottom 0.2: U$4.P19 26.67,13.92 30.25,17.5 48,17.5 55.5,10 69.75,10 v70.5,9.75
4.27  (via drill 0.5)
  Top 0.2: U$8.P$30 69.41,10.16 69.75,10.5 v72.75,10.5
  Bottom 0.2: U$4.P22 24.13,15.38 26.75,18 48.25,18 55.75,10.5 v72.75,10.5
4.28  (via drill 0.5)
  Top 0.2: U$8.P$31 69.05,10.79 69.5,11.25 v70.5,11.25
  Bottom 0.2: U$4.P23 22.86,15.36 26,18.5 48.5,18.5 56,11 69.75,11 v70.5,11.25
4.29  (via drill 0.5)
  Top 0.2: U$8.P$32 68.68,11.43 69.25,12 v72.75,12
  Bottom 0.2: U$4.P26 20.32,15.82 23.5,19 48.75,19 56.25,11.5 68.75,11.5 69.25,12 v72.75,12
4.30  (via drill 0.5)
  Top 0.2: U$8.P$33 68.31,12.06 69,12.75 v70.5,12.75
  Bottom 0.2: U$4.P27 19.05,16.8 21.75,19.5 49,19.5 56.5,12 68.25,12 69,12.75 v70.5,12.75
4.31  (via drill 0.5)
  Top 0.2: U$8.P$34 67.95,12.7 68.75,13.5 v72.75,13.5
  Bottom 0.2: U$4.P30 16.51,16.26 20.25,20 49.25,20 56.75,12.5 67.75,12.5 68.75,13.5 v72.75,13.5
4.32  (via drill 0.5)
  Top 0.2: U$8.P$35 67.58,13.34 68.5,14.25 v70.5,14.25
  Bottom 0.2: U$4.P31 15.24,16.49 19.25,20.5 49.5,20.5 57,13 67.25,13 68.5,14.25 v70.5,14.25
C1.29  (via drill 0.5 pad 0.25)
  Top 0.2: U$1.P26 20.32,73.82 23,76.5 69.75,76.5 v70.25,76
  Bottom 0.2: v70.25,76 74.5,71.75 JP4.1
C1.30  (via drill 0.5 pad 0.25)
  Top 0.2: U$1.P27 19.05,74.3 21.75,77 70.5,77 v71.5,76
  Bottom 0.2: v71.5,76 74.5,73 81,73 82.25,71.75 JP2.1
C1.31  (via drill 0.5 pad 0.25)
  Top 0.2: U$1.P30 16.51,73.01 21,77.5 71.25,77.5 v72.75,76
  Bottom 0.2: v72.75,76 74.75,74 85.25,74 87.5,71.75 JP1.1
C1.32  (via drill 0.5 pad 0.25)
  Top 0.2: U$1.P31 15.24,74.49 18.75,78 72,78 v74,76
  Bottom 0.2: v74,76 74.75,75.25 89.25,75.25 92.75,71.75 JP3.1
GND  (via drill 0.5)
  Top 0.2: U$8.P$19 67.58,3.17 68.5,2.25 v70.5,2.25 | U$8.P$1 63.28,13.97 v62.5,14.75
  other vias: 62.5,75.75 70.25,62.75 62.5,56.75 70.25,44 62.5,35 70.5,22.5
  pour Bottom: -1.27,81.28 101.6,81.28 101.6,-2.54 -1.27,-2.54
  pour Top: -1.27,81.28 101.6,81.28 101.6,-2.54 -1.27,-2.54
J29
  Bottom 0.2: JP4.3 80.01,56.26 78,54.25 78,28.75 79.25,27.5 92.52,27.5 JP6.1
J30
  Bottom 0.2: JP2.3 85.09,56.09 83.25,54.25 83.25,37.25 90.5,30 92.56,30 JP6.3
J31
  Bottom 0.2: JP1.3 90.17,55.92 88.25,54 88.25,34.75 90.5,32.5 92.59,32.5 JP6.5
J32
  Bottom 0.2: JP3.3 95.25,56 93.5,54.25 93.5,34.13 JP6.7
N$10  (via drill 0.5 pad 0.25)
  Top 0.2: U$5.P$22 67.46,66.04 68.5,65 v72.5,65
  Bottom 0.2: U$1.1.6 39.94,72.69 41.25,74 45,74 45.75,73.25 45.75,70.75 46.75,69.75 46.75,67.75 50,64.5 69.25,64.5 69.75,65 v72.5,65
REF  (via drill 0.5)
  Top 0.2: 95.17,50.25 JP13.2 | 76.5,74.93 77,74.93 94.57,74.93 97.25,72.25 97.25,52.16 JP13.2 | U$1.Z1 29.21,70.46 28.5,69.75 27.5,69.75 27,70.25 26.25,70.25 25.75,69.75 25,69.75 24.5,70.25 23.75,70.25 23.25,69.75 22.5,69.75 22.25,70 21.25,70 21,69.75 20,69.75 19.75,70 18.5,70 18.25,69.75 17.25,69.75 17,70 16,70 15.75,69.75 14.5,69.75 12.75,71.5 12.75,73.25 18,78.5 72.93,78.5 76.5,74.93 | JP13.2 93.25,48.16 93.25,37.75 89.75,34.25 89.75,31.96 JP7.1 83.82,23.57 v83,22.75 | U$5.P$18 63.38,64.14 62.75,63.5 62.75,62.75 63.5,62 v72.5,62 | U$5.P$36 76.5,74.93
  Bottom 0.2: v83,22.75 83,24.75 82.75,25 80.5,25 77,28.5 77,61.5 76.5,62 v72.5,62
REF1  (via drill 0.5)
  Top 0.2: U$6.P$36 67.13,55.88 68.25,57 68.5,57 | 68.5,57 91.25,57 92.25,56 92.25,52.24 JP15.2 | 90.08,50.25 JP15.2 | U$2.Z1 29.21,54.46 32.5,57.75 67.75,57.75 68.5,57 | JP15.2 88.25,48.24 88.25,33.01 JP7.3 83.82,27.57 82.75,26.5 82.75,23.75 v81.75,22.75 | U$6.P$18 63.34,45.09 62.75,44.5 62.75,43.75 63.25,43.25 v72.5,43.25
  Bottom 0.2: 90.08,50.25 JP15.2 | v81.75,22.75 81.75,24 81.5,24.25 80,24.25 76,28.25 76,42.25 75,43.25 v72.5,43.25
REF2  (via drill 0.5)
  Top 0.2: U$7.P$36 67.79,34.29 69.75,36.25 | 84.92,50 JP17.2 | 69.75,36.25 73.75,40.25 73.75,54.25 75.25,55.75 86.5,55.75 87,55.25 87,52.08 JP17.2 | U$3.Z1 29.21,34.21 31.25,36.25 69.75,36.25 | U$7.P$18 63.26,23.5 63.25,23.5 62.5,22.75 62.5,22 62.75,21.75 v72.75,21.75 | JP17.2 85.33,50.16 | JP17.2 84.42,50.16 83.25,49 83.25,40.5 86.5,37.25 86.5,33.8 JP7.5 83.82,30.07 82.75,29 82.75,28 82.25,27.5 81.25,27.5 80.25,26.5 80.25,23 v80.5,22.75
  Bottom 0.2: v80.5,22.75 80.5,23.25 80.25,23.5 74.5,23.5 v72.75,21.75
REF3  (via drill 0.5)
  Top 0.2: U$8.P$36 67.22,13.97 69.25,16 | 69.25,16 75.75,22.5 75.75,53.75 76.5,54.5 81.5,54.5 82,54 82,52.16 JP19.2 79.92,50.16 78,48.25 78,43.5 83.75,37.75 83.75,33.73 JP7.7 82.42,32.25 80.5,32.25 79.25,31 v79.25,22.75 | U$4.Z1 29.21,13.71 31.5,16 69.25,16 | U$8.P$18 63.17,3.17 62.5,2.5 62.5,2 63,1.5 v72.75,1.5
  Bottom 0.2: v79.25,22.75 75.25,22.75 75,22.5 75,3 73.5,1.5 v72.75,1.5

### Text on the board
tNames: C1 | OMN | PIN OUT | JMP | Connector 1 | PIN1 | PIN2 | PIN3 | PIN4 | JMP | REF | REF OUT | GND | Connector 2 | con 1 | con 2 | con 3 | con 4 | JMP OUT | Connector 3 | REF | con | C1 | pin | Connector 4 | EEG breakout board | version 2.0, January 2015 / design at open-ephys.org